# EAGLE design Level shifter (EAGLE 6.3)
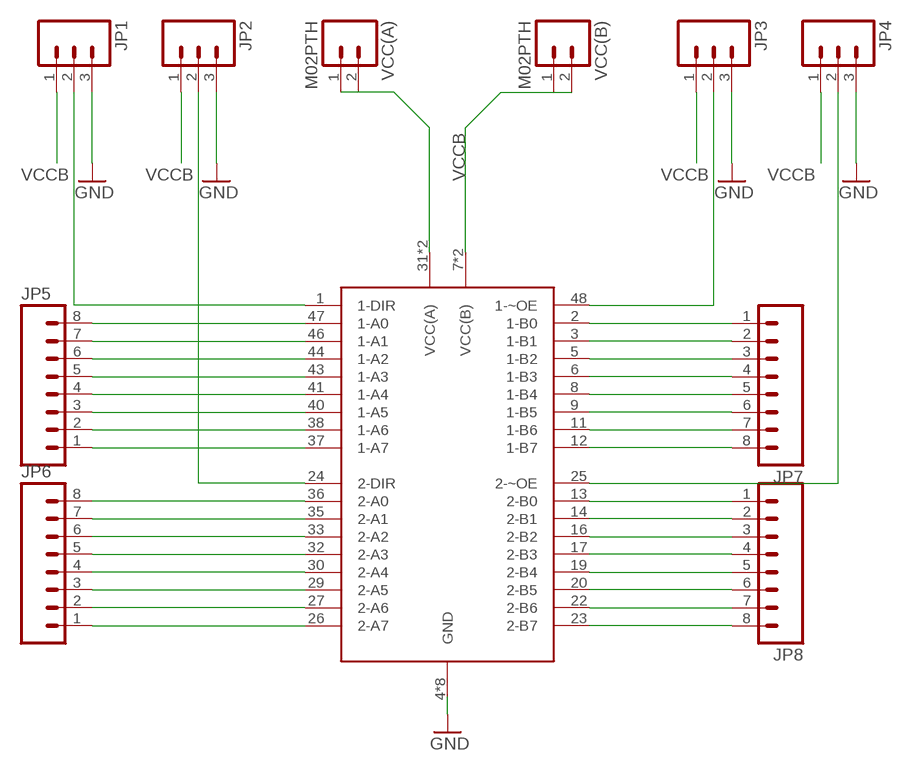
[diagram p0: schematic, sheet 1]

## Parts
JP1  M03PTH  [1X03]
JP2  M03PTH  [1X03]
JP3  M03PTH  [1X03]
JP4  M03PTH  [1X03]
JP5  M081X08  [1X08]
JP6  M081X08  [1X08]
JP7  M081X08  [1X08]
JP8  M081X08  [1X08]
U$1  74AVC8T245TSSOP  [TSSOP-48]
VCC(A)  M02PTH  [1X02]
VCC(B)  M02PTH  [1X02]

## Nets
1-DIR: JP1.2 U$1.1(1-DIR)
1-~OE: JP3.2 U$1.48(1-~OE)
1A0: JP5.8 U$1.47(1-A0)
1A1: JP5.7 U$1.46(1-A1)
1A2: JP5.6 U$1.44(1-A2)
1A3: JP5.5 U$1.43(1-A3)
1A4: JP5.4 U$1.41(1-A4)
1A5: JP5.3 U$1.40(1-A5)
1A6: JP5.2 U$1.38(1-A6)
1A7: JP5.1 U$1.37(1-A7)
1B0: JP7.1 U$1.2(1-B0)
1B1: JP7.2 U$1.3(1-B1)
1B2: JP7.3 U$1.5(1-B2)
1B3: JP7.4 U$1.6(1-B3)
1B4: JP7.5 U$1.8(1-B4)
1B5: JP7.6 U$1.9(1-B5)
1B6: JP7.7 U$1.11(1-B6)
1B7: JP7.8 U$1.12(1-B7)
2-DIR: JP2.2 U$1.24(2-DIR)
2-~OE: JP4.2 U$1.25(2-~OE)
2A0: JP6.8 U$1.36(2-A0)
2A1: JP6.7 U$1.35(2-A1)
2A2: JP6.6 U$1.33(2-A2)
2A3: JP6.5 U$1.32(2-A3)
2A4: JP6.4 U$1.30(2-A4)
2A5: JP6.3 U$1.29(2-A5)
2A6: JP6.2 U$1.27(2-A6)
2A7: JP6.1 U$1.26(2-A7)
2B0: JP8.1 U$1.13(2-B0)
2B1: JP8.2 U$1.14(2-B1)
2B2: JP8.3 U$1.16(2-B2)
2B3: JP8.4 U$1.17(2-B3)
2B4: JP8.5 U$1.19(2-B4)
2B5: JP8.6 U$1.20(2-B5)
2B6: JP8.7 U$1.22(2-B6)
2B7: JP8.8 U$1.23(2-B7)
GND: JP1.3 JP2.3 JP3.3 JP4.3 U$1.4(GND) U$1.10(GND) U$1.15(GND) U$1.21(GND) U$1.28(GND) U$1.34(GND) U$1.39(GND) U$1.45(GND)
VCC(A): U$1.31(VCC(A)) U$1.42(VCC(A)) VCC(A).1 VCC(A).2
VCCB: JP1.1 JP2.1 JP3.1 JP4.1 U$1.7(VCC(B)) U$1.18(VCC(B)) VCC(B).1 VCC(B).2

## Library data of the parts
JP1-JP4 = SparkFun-Connectors:M03: Header 3 Standard 3-pin 0.1" header. Use with straight break away headers (SKU : PRT-00116), right angle break away headers (PRT-00553), swiss pins (PRT-00743), machine pins (PRT-00117), and female headers (PRT-00115). Molex polarized connector foot print use with SKU : PRT-08232 with associated crimp pins and housings.
JP5-JP8 = SparkFun-Connectors:M08: Header 8 Standard 8-pin 0.1" header. Use with straight break away headers (SKU : PRT-00116), right angle break away headers (PRT-00553), swiss pins (PRT-00743), machine pins (PRT-00117), and female headers (PRT-00115).
U$1 = Strutz Electronic Industries:74AVC8T245
VCC(A) VCC(B) = SparkFun-Connectors:M02: Standard 2-pin 0.1" header. Use with - straight break away headers ( PRT-00116) - right angle break away headers (PRT-00553) - swiss pins (PRT-00743) - machine pins (PRT-00117) - female headers (PRT-00115) Molex polarized connector foot print use with: PRT-08233 with associated crimp pins and housings. 2.54_SCREWTERM for use with PRT-10571. 3.5mm Screw Terminal footprints for PRT-08084 5mm Screw Terminal footprints for use with PRT-08433

## Board
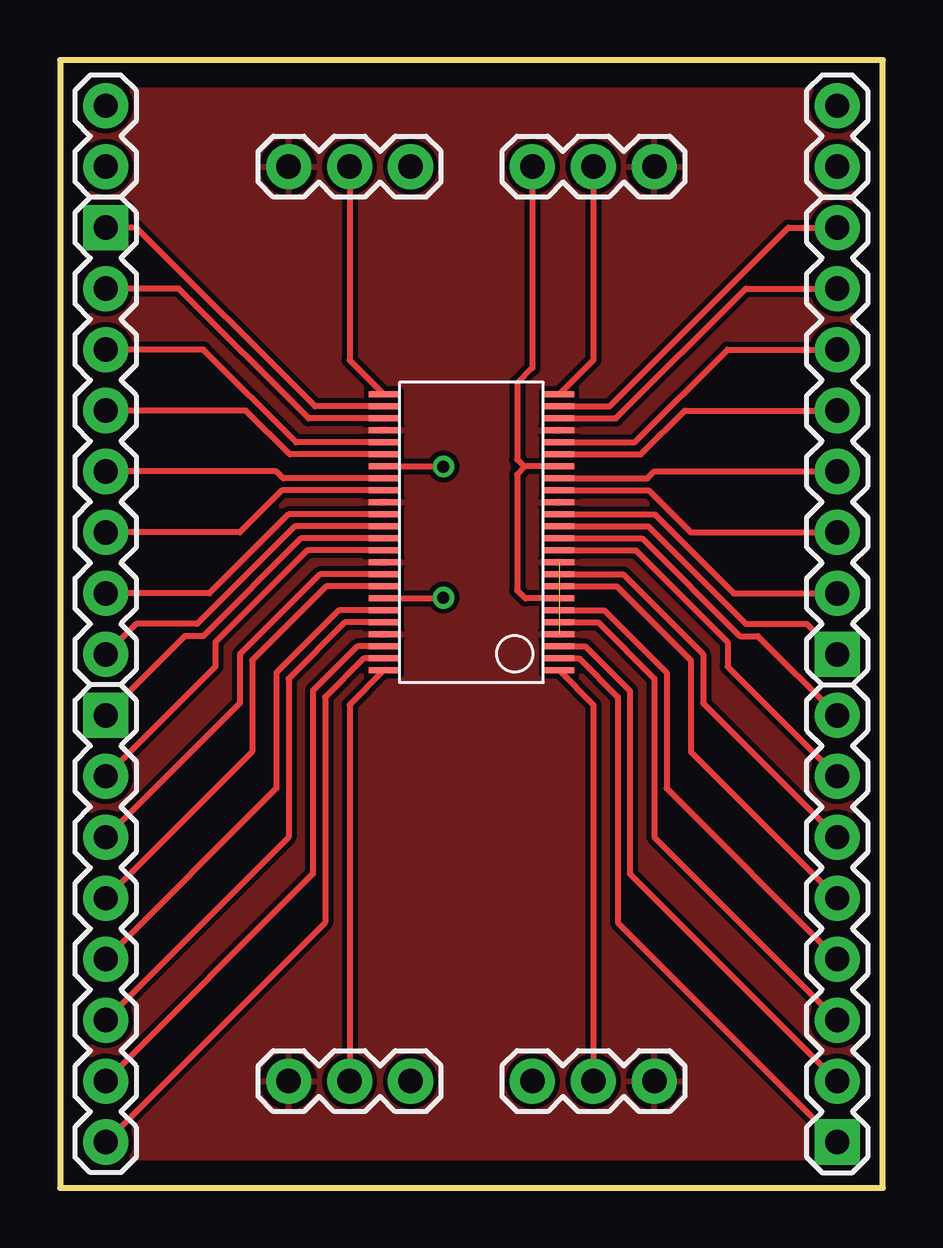
[diagram p1: board, top side]
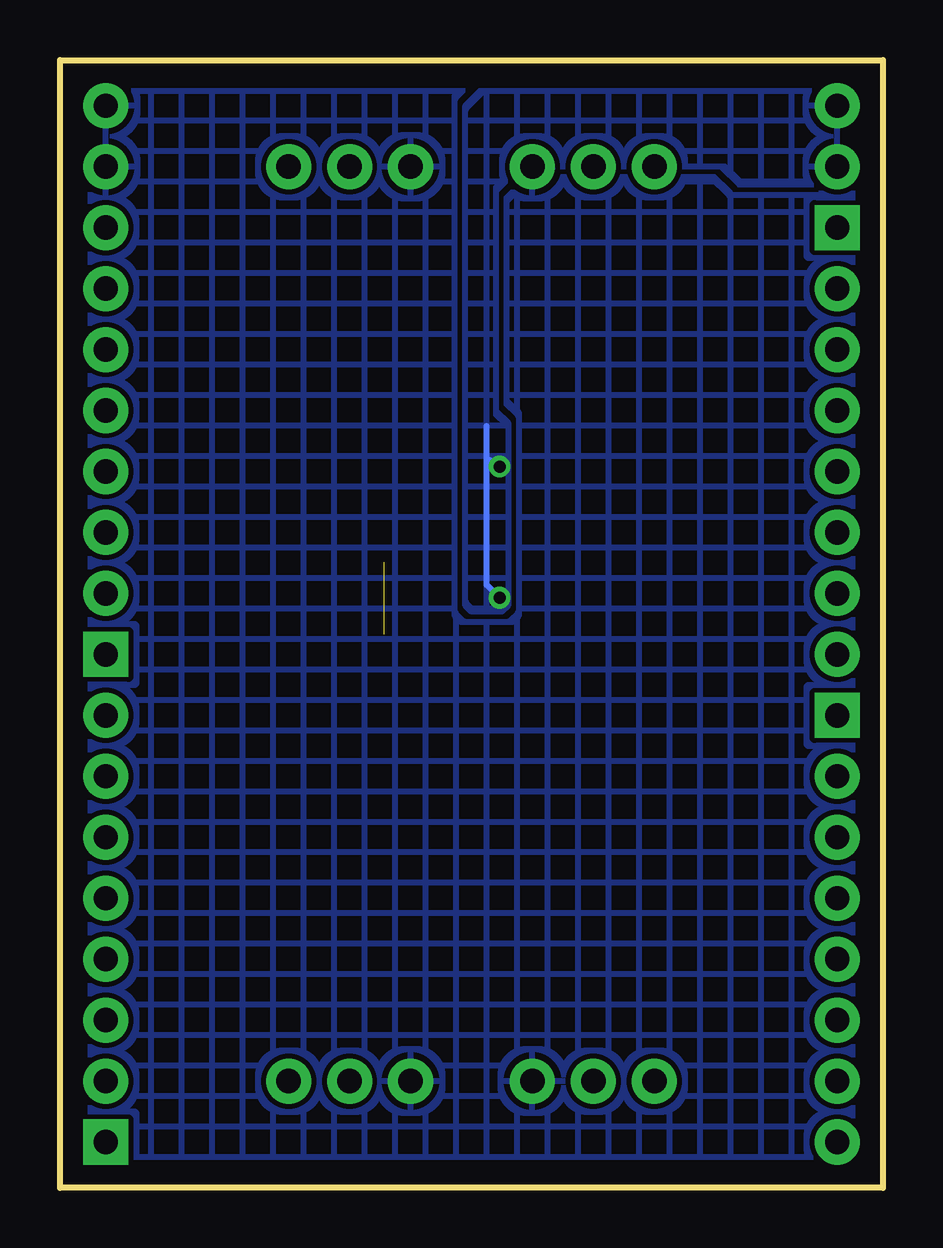
[diagram p2: board, bottom side, seen from below]

Size 34.29 x 46.99 mm. Coordinates in mm from the lower left corner, seen from the top.
Outline: 34.29,46.99 0,46.99 0,0 34.29,0 34.29,46.99
Copper layers (1*16): Top 0.035mm / dielectric 1.5mm / Bottom 0.035mm
Design rules "default": minimum track width 10mil, minimum drill 24mil, track to track 8mil, track to pad 8mil, pad to pad 8mil, via to via 8mil, smd to smd 8mil, copper to edge 40mil, drill to drill 8mil, minimum pad ring 10mil, minimum via ring 8mil, stop-mask expansion 4mil, vias tented up to drill 0mil, thermal gap 10mil

### Footprints (pad centres in the part's own frame; a part is rotated, then mirrored left to right if it is on the bottom)
1X03 = drill 1.016 pad 1.88: 1 0,0; 2 2.54,0; 3 5.08,0
1X08 = drill 1.016 pad 1.88 square: 1 0,0 | drill 1.016 pad 1.88: 2 2.54,0; 3 5.08,0; 4 7.62,0; 5 10.16,0; 6 12.7,0; 7 15.24,0; 8 17.78,0
TSSOP-48 = smd 0.25 x 1.25: 1 -5.75,-3.65; 2 -5.25,-3.65; 3 -4.75,-3.65; 4 -4.25,-3.65; 5 -3.75,-3.65; 6 -3.25,-3.65; 7 -2.75,-3.65; 8 -2.25,-3.65; 9 -1.75,-3.65; 10 -1.25,-3.65; 11 -0.75,-3.65; 12 -0.25,-3.65; 13 0.25,-3.65; 14 0.75,-3.65; 15 1.25,-3.65; 16 1.75,-3.65; 17 2.25,-3.65; 18 2.75,-3.65; 19 3.25,-3.65; 20 3.75,-3.65; 21 4.25,-3.65; 22 4.75,-3.65; 23 5.25,-3.65; 24 5.75,-3.65; 25 5.75,3.65; 26 5.25,3.65; 27 4.75,3.65; 28 4.25,3.65; 29 3.75,3.65; 30 3.25,3.65; 31 2.75,3.65; 32 2.25,3.65; 33 1.75,3.65; 34 1.25,3.65; 35 0.75,3.65; 36 0.25,3.65; 37 -0.25,3.65; 38 -0.75,3.65; 39 -1.25,3.65; 40 -1.75,3.65; 41 -2.25,3.65; 42 -2.75,3.65; 43 -3.25,3.65; 44 -3.75,3.65; 45 -4.25,3.65; 46 -4.75,3.65; 47 -5.25,3.65; 48 -5.75,3.65
1X02 = drill 1.016 pad 1.88: 1 0,0; 2 2.54,0

### Placement (x,y rotation side)
JP1  19.68,4.45 0 top
JP2  19.68,42.55 0 top
JP3  14.61,4.45 180 top
JP4  14.61,42.55 180 top
JP5  1.91,19.68 270 top
JP6  1.91,40.01 270 top
JP7  32.38,1.91 90 top
JP8  32.38,22.23 90 top
U$1  17.14,27.3 90 top
VCC(A)  1.91,45.09 270 top
VCC(B)  32.38,45.09 270 top

### Tracks (layer width: path | path; a pad name or v marks a point on that pad's centre or on a via)
1-DIR
  Top 0.254: U$1.1 22.23,20.12 JP1.2
1-~OE
  Top 0.254: U$1.48 12.06,20.12 JP3.2
1A0
  Top 0.254: U$1.47 12.66,22.05 11.05,20.45 11.05,11.05 JP5.8
1A1
  Top 0.254: U$1.46 12.39,22.55 10.54,20.7 10.54,13.08 JP5.7
1A2
  Top 0.254: U$1.44 11.87,23.55 9.53,21.21 9.53,14.61 JP5.6
1A3
  Top 0.254: U$1.43 11.61,24.05 9.02,21.46 9.02,16.64 JP5.5
1A4
  Top 0.254: U$1.41 11.09,25.05 8,21.97 8,18.16 JP5.4
1A5
  Top 0.254: U$1.40 10.82,25.55 7.49,22.23 7.49,20.19 JP5.3
1A6
  Top 0.254: U$1.38 10.3,26.55 6.48,22.73 6.48,21.72 JP5.2
1A7
  Top 0.254: U$1.37 10.04,27.05 5.97,22.99 5.21,22.99 JP5.1
1B0
  Top 0.254: U$1.2 21.63,22.05 23.24,20.45 23.24,11.05 JP7.1
1B1
  Top 0.254: U$1.3 21.89,22.55 23.75,20.7 23.75,13.08 JP7.2
1B2
  Top 0.254: U$1.5 22.42,23.55 24.77,21.21 24.77,14.61 JP7.3
1B3
  Top 0.254: U$1.6 22.68,24.05 25.27,21.46 25.27,16.64 JP7.4
1B4
  Top 0.254: U$1.8 23.2,25.05 26.29,21.97 26.29,18.16 JP7.5
1B5
  Top 0.254: U$1.9 23.47,25.55 26.8,22.23 26.8,20.19 JP7.6
1B6
  Top 0.254: U$1.11 23.99,26.55 27.81,22.73 27.81,21.72 JP7.7
1B7
  Top 0.254: U$1.12 24.25,27.05 28.32,22.99 29.08,22.99 JP7.8
2-DIR
  Top 0.254: JP2.2 22.23,34.48 U$1.24
2-~OE
  Top 0.254: JP4.2 12.06,34.48 U$1.25
2A0
  Top 0.254: U$1.36 9.78,27.55 5.71,23.5 3.17,23.5 JP6.8
2A1
  Top 0.254: U$1.35 9.51,28.05 6.22,24.77 JP6.7
2A2
  Top 0.254: U$1.33 9.24,29.05 7.49,27.3 JP6.6
2A3
  Top 0.254: U$1.32 9.31,29.55 9.02,29.84 JP6.5
2A4
  Top 0.254: U$1.30 9.58,30.55 7.75,32.38 JP6.4
2A5
  Top 0.254: U$1.29 9.84,31.05 5.97,34.92 JP6.3
2A6
  Top 0.254: U$1.27 10.36,32.05 4.95,37.47 JP6.2
2A7
  Top 0.254: U$1.26 10.62,32.55 3.17,40.01 JP6.1
2B0
  Top 0.254: U$1.13 24.52,27.55 28.57,23.5 31.11,23.5 JP8.1
2B1
  Top 0.254: U$1.14 24.78,28.05 28.07,24.77 JP8.2
2B2
  Top 0.254: U$1.16 24.54,29.05 26.29,27.3 JP8.3
2B3
  Top 0.254: U$1.17 24.48,29.55 24.77,29.84 JP8.4
2B4
  Top 0.254: U$1.19 24.2,30.55 26.04,32.38 JP8.5
2B5
  Top 0.254: U$1.20 23.94,31.05 27.81,34.92 JP8.6
2B6
  Top 0.254: U$1.22 23.16,32.05 28.57,37.47 JP8.7
2B7
  Top 0.254: U$1.23 22.9,32.55 30.35,40.01 JP8.8
GND  (1 unrouted)
  pour Top: 34.29,46.99 0,46.99 0,0 34.29,0
VCC(A)  (via drill 0.5 pad 0.25)
  Top 0.254: U$1.31 15.46,30.05 v15.98,30.05 | U$1.42 15.44,24.55 v15.98,24.59
  Bottom 0.254: v15.98,30.05 15.7,30.05 16.51,30.35 | 16.51,30.35 16.51,31.75 | v15.98,24.59 16.51,25.12 16.51,30.35
  pour Bottom (hatched): 15.62,31.88 15.62,24.26 15.88,24 17.14,24 17.4,24.26 17.4,45.09 16.64,45.85 1.4,45.85 0.89,45.34 0.89,42.55 1.65,41.78 5.97,41.78 6.73,42.55 15.11,42.55 16.13,41.53 16.13,32.38
VCCB
  Top 0.254: JP2.1 19.68,34.16 19.05,33.53 19.05,30.35 19.35,30.05 U$1.18 19.39,30.05 19.05,29.72 19.05,24.89 19.39,24.55 U$1.7
  pour Bottom (rank 3, hatched): 34.29,46.99 0,46.99 0,0 34.29,0